# Altium project DSKY_keyboard.PrjPcb
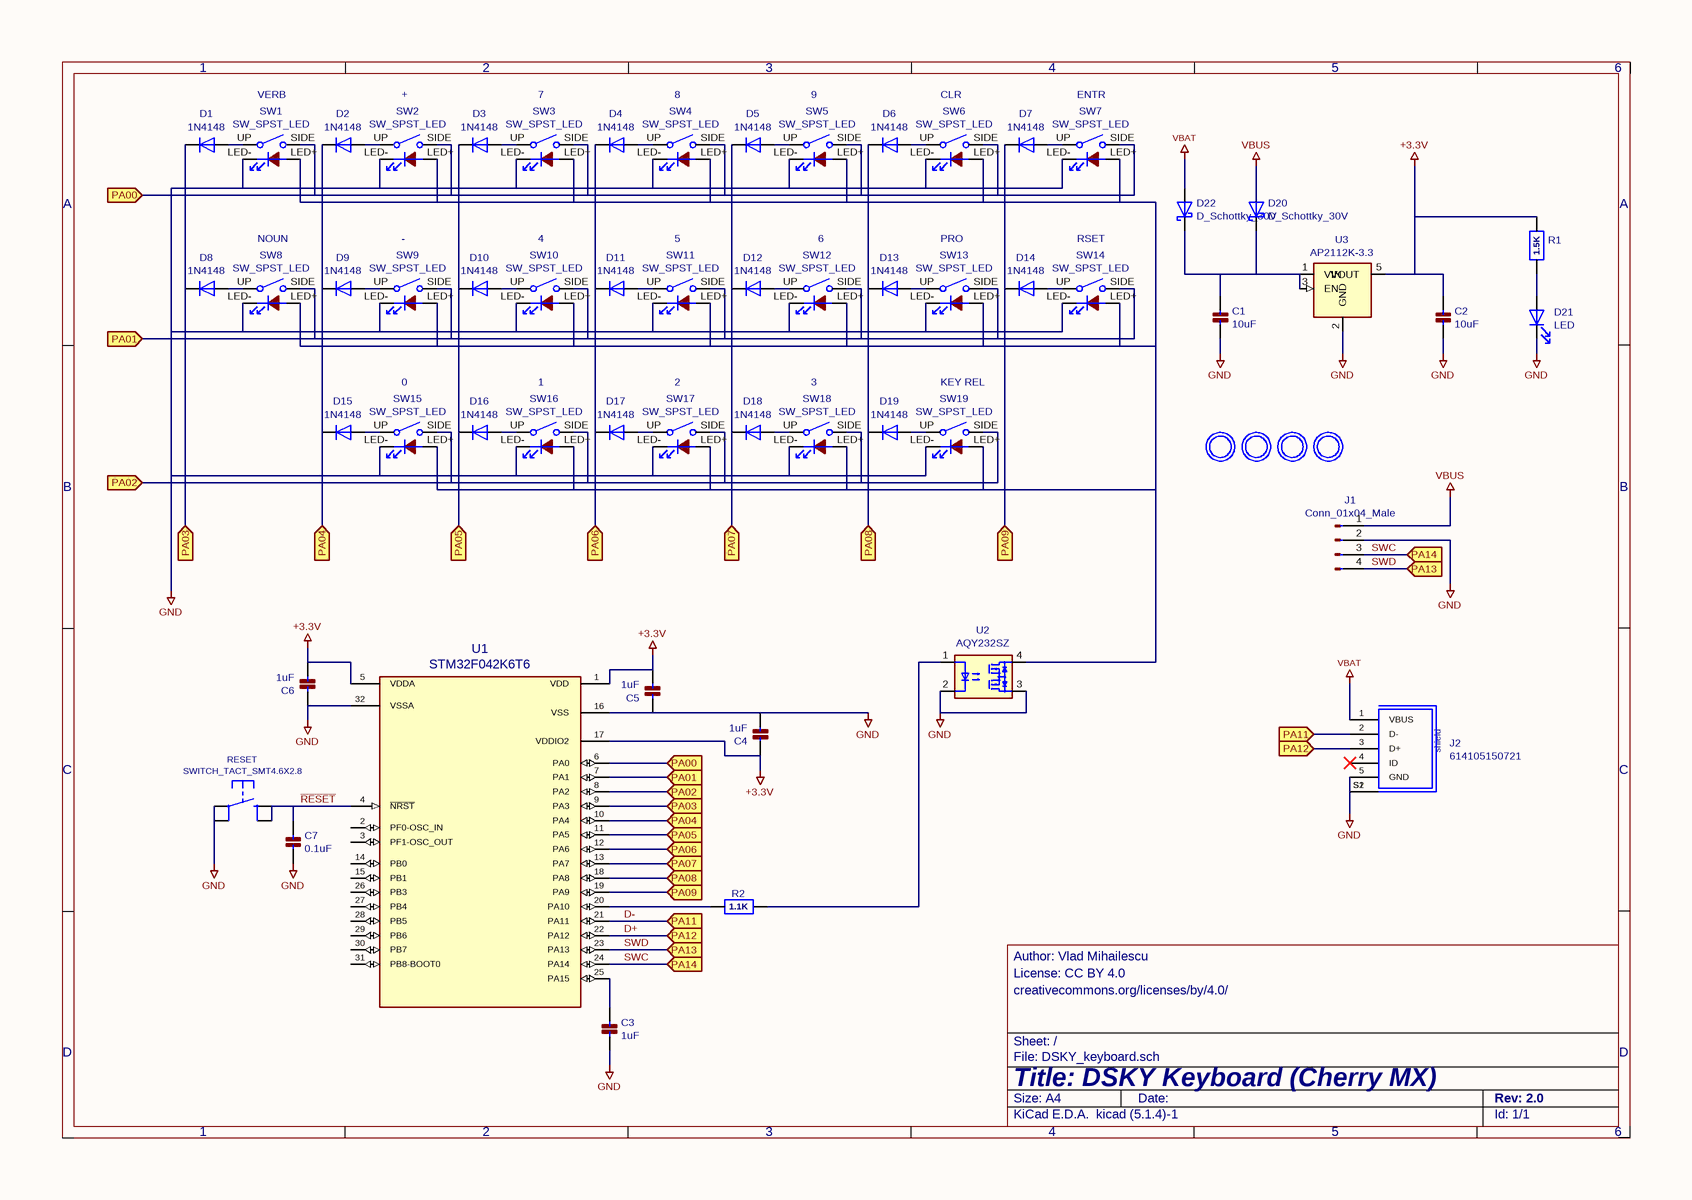
[diagram p0: DSKY_keyboard.SchDoc]
1 sheet, 60 parts. Net scope: flat (ports and power ports of the same name join across sheets).
Board file: DSKY_keyboard.PcbDoc

## Sheet DSKY_keyboard.SchDoc
size 297 x 210 mm

### Parts
C1  10uF  [0805-NO]
C2  10uF  [0805-NO]
C3  1uF  [0603-NO]
C4  1uF  [0603-NO]
C5  1uF  [0603-NO]
C6  1uF  [0603-NO]
C7  0.1uF  [0603-NO]
D1  1N4148  [SOD-123]
D2  1N4148  [SOD-123]
D3  1N4148  [SOD-123]
D4  1N4148  [SOD-123]
D5  1N4148  [SOD-123]
D6  1N4148  [SOD-123]
D7  1N4148  [SOD-123]
D8  1N4148  [SOD-123]
D9  1N4148  [SOD-123]
D10  1N4148  [SOD-123]
D11  1N4148  [SOD-123]
D12  1N4148  [SOD-123]
D13  1N4148  [SOD-123]
D14  1N4148  [SOD-123]
D15  1N4148  [SOD-123]
D16  1N4148  [SOD-123]
D17  1N4148  [SOD-123]
D18  1N4148  [SOD-123]
D19  1N4148  [SOD-123]
D20  D_Schottky_30V  [SOD-123FL]
D21  LED  [CHIPLED_0603_NOOUTLINE]
D22  D_Schottky_30V  [SOD-123FL]
J1  Conn_01x04_Male  [PinHeader_1x04_P2.54mm_Horizontal]
J2  614105150721  [614105150721]
J3  MOUNTINGHOLE3.0  [MOUNTINGHOLE_2.0_PLATED]  (value not drawn)
J4  MOUNTINGHOLE3.0  [MOUNTINGHOLE_2.0_PLATED]  (value not drawn)
J5  MOUNTINGHOLE3.0  [MOUNTINGHOLE_2.0_PLATED]  (value not drawn)
J6  MOUNTINGHOLE3.0  [MOUNTINGHOLE_2.0_PLATED]  (value not drawn)
R1  1.5K  [0603-NO]
R2  1.1K  [0603-NO]
RESET  SWITCH_TACT_SMT4.6X2.8  [BTN_KMR2_4.6X2.8]
SW1  SW_SPST_LED  [CHERRYMX-NN-LED]
SW2  SW_SPST_LED  [CHERRYMX-NN-LED]
SW3  SW_SPST_LED  [CHERRYMX-NN-LED]
SW4  SW_SPST_LED  [CHERRYMX-NN-LED]
SW5  SW_SPST_LED  [CHERRYMX-NN-LED]
SW6  SW_SPST_LED  [CHERRYMX-NN-LED]
SW7  SW_SPST_LED  [CHERRYMX-NN-LED]
SW8  SW_SPST_LED  [CHERRYMX-NN-LED]
SW9  SW_SPST_LED  [CHERRYMX-NN-LED]
SW10  SW_SPST_LED  [CHERRYMX-NN-LED]
SW11  SW_SPST_LED  [CHERRYMX-NN-LED]
SW12  SW_SPST_LED  [CHERRYMX-NN-LED]
SW13  SW_SPST_LED  [CHERRYMX-NN-LED]
SW14  SW_SPST_LED  [CHERRYMX-NN-LED]
SW15  SW_SPST_LED  [CHERRYMX-NN-LED]
SW16  SW_SPST_LED  [CHERRYMX-NN-LED]
SW17  SW_SPST_LED  [CHERRYMX-NN-LED]
SW18  SW_SPST_LED  [CHERRYMX-NN-LED]
SW19  SW_SPST_LED  [CHERRYMX-NN-LED]
U1  STM32F042K6T6  [STM32F042K6T6]
U2  AQY232SZ  [SO-4_4.4x4.3mm_P2.54mm]
U3  AP2112K-3.3  [SOT23-5]

### Ports
PA00 (in), PA01 (in), PA02 (in), PA03 (in), PA04 (in), PA05 (in), PA06 (in), PA07 (in), PA08 (in), PA09 (in), PA11 (in), PA12 (in), PA13 (in), PA14 (in)

### Nets
+3.3V: C2.1 C4.1 C5.2 C6.2 R1.1 U1.1(VDD) U1.5(VDDA) U1.17(VDDIO2) U3.5(VOUT)
GND: C1.2 C2.2 C3.2 C4.2 C5.1 C6.1 C7.2 D21.1(K) J1.2(Pin_2) J2.5(GND) J2.S1 J2.S2 RESET.A(P) RESET.A'(P1) SW1.LED- SW2.LED- SW3.LED- SW4.LED- SW5.LED- SW6.LED- SW7.LED- SW8.LED- SW9.LED- SW10.LED- SW11.LED- SW12.LED- SW13.LED- SW14.LED- SW15.LED- SW16.LED- SW17.LED- SW18.LED- SW19.LED- U1.16(VSS) U1.32(VSSA) U2.2 U2.3 U3.2(GND)
VBAT: D22.2(A) J2.1(VBUS)
VBUS: D20.2(A) J1.1(Pin_1)
D+: J2.3(D+) U1.22(PA12) ; port PA12
D-: J2.2(D-) U1.21(PA11) ; port PA11
PA00: SW1.SIDE SW2.SIDE SW3.SIDE SW4.SIDE SW5.SIDE SW6.SIDE SW7.SIDE U1.6(PA0) ; port PA00
PA01: SW8.SIDE SW9.SIDE SW10.SIDE SW11.SIDE SW12.SIDE SW13.SIDE SW14.SIDE U1.7(PA1) ; port PA01
PA02: SW15.SIDE SW16.SIDE SW17.SIDE SW18.SIDE SW19.SIDE U1.8(PA2) ; port PA02
PA03: D1.1(K) D8.1(K) U1.9(PA3) ; port PA03
PA04: D2.1(K) D9.1(K) D15.1(K) U1.10(PA4) ; port PA04
PA05: D3.1(K) D10.1(K) D16.1(K) U1.11(PA5) ; port PA05
PA06: D4.1(K) D11.1(K) D17.1(K) U1.12(PA6) ; port PA06
PA07: D5.1(K) D12.1(K) D18.1(K) U1.13(PA7) ; port PA07
PA08: D6.1(K) D13.1(K) D19.1(K) U1.18(PA8) ; port PA08
PA09: D7.1(K) D14.1(K) U1.19(PA9) ; port PA09
~{RESET}: C7.1 RESET.B(S) RESET.B'(S1) U1.4(~{NRST})
SWC: J1.3(Pin_3) U1.24(PA14) ; port PA14
SWD: J1.4(Pin_4) U1.23(PA13) ; port PA13
NetC1_1: C1.1 D20.1(K) D22.1(K) U3.1(VIN) U3.3(EN)
NetC3_1: C3.1 U1.25(PA15)
NetD1_2: D1.2(A) SW1.UP
NetD2_2: D2.2(A) SW2.UP
NetD3_2: D3.2(A) SW3.UP
NetD4_2: D4.2(A) SW4.UP
NetD5_2: D5.2(A) SW5.UP
NetD6_2: D6.2(A) SW6.UP
NetD7_2: D7.2(A) SW7.UP
NetD8_2: D8.2(A) SW8.UP
NetD9_2: D9.2(A) SW9.UP
NetD10_2: D10.2(A) SW10.UP
NetD11_2: D11.2(A) SW11.UP
NetD12_2: D12.2(A) SW12.UP
NetD13_2: D13.2(A) SW13.UP
NetD14_2: D14.2(A) SW14.UP
NetD15_2: D15.2(A) SW15.UP
NetD16_2: D16.2(A) SW16.UP
NetD17_2: D17.2(A) SW17.UP
NetD18_2: D18.2(A) SW18.UP
NetD19_2: D19.2(A) SW19.UP
NetD21_2: D21.2(A) R1.2
NetR2_1: R2.1 U2.1
NetR2_2: R2.2 U1.20(PA10)
NetSW1_LED+: SW1.LED+ SW2.LED+ SW3.LED+ SW4.LED+ SW5.LED+ SW6.LED+ SW7.LED+ SW8.LED+ SW9.LED+ SW10.LED+ SW11.LED+ SW12.LED+ SW13.LED+ SW14.LED+ SW15.LED+ SW16.LED+ SW17.LED+ SW18.LED+ SW19.LED+ U2.4

Not connected (* = marked no-connect by the designer): J2 4(ID)*; U1 2(PF0-OSC_IN) 3(PF1-OSC_OUT) 14(PB0) 15(PB1) 26(PB3) 27(PB4) 28(PB5) 29(PB6) 30(PB7) 31(PB8-BOOT0); U3 4(NC)

### Notes on the sheet
- VERB
- +
- 7
- 8
- 9
- CLR
- ENTR
- NOUN
- -
- 4
- 5
- (near SW12) 6
- PRO
- RSET
- 0
- 1
- 2
- 3
- KEY
  REL
- A
- B
- C
- creativecommons.org/licenses/by/4.0/ <http://creativecommons.org/licenses/by/4.0/>
- License: CC BY 4.0
- Author: Vlad Mihailescu
- D
- Title: DSKY Keyboard (Cherry MX)
- File: DSKY_keyboard.sch
- Sheet: /
- KiCad E.D.A.  kicad (5.1.4)-1
- Size: A4
- Date:
- Rev: 2.0
- Id: 1/1
- (in symbol 614105150721) shield

### Library data of the parts
C1-C7 = CAP_CERAMIC0805-NOOUTLINE
  C1 C2: Value: 10uF; Footprint: Trinket M0 rev D:0805-NO
  C3-C6: Value: 1uF; Footprint: Trinket M0 rev D:0603-NO
  C7: Value: 0.1uF; Footprint: Trinket M0 rev D:0603-NO
D20 D22 = D_Schottky: Value: D_Schottky_30V; Footprint: Trinket M0 rev D:SOD-123FL
J2 = 614105150721: INTERFACE-TYPE: Type B; GERDER: Receptacle; IR1: 1.8A; WORKING-VOLTAGE: 30V(AC); PACKAGING: Tape and Reel; TYPE: Vertical; DATASHEET-URL: https://www.we-online.com/catalog/datasheet/614105150721.pdf; PINS: 5; VALUE: 614105150721; APPLICATION: Micro USB 2.0; PART-NUMBER: 614105150721; MOUNT: THT; Value: 614105150721; Footprint: Footprints:614105150721
R1 R2 = RESISTOR_0603_NOOUT: Footprint: Trinket M0 rev D:0603-NO
  R1: Value: 1.5K
  R2: Value: 1.1K
SW1-SW19 = SW_GATERON_LED: Value: SW_SPST_LED; Footprint: Trinket M0 rev D:CHERRYMX-NN-LED
D1-D19 = 1N4148: Value: 1N4148; Footprint: digikey-footprints:SOD-123
D21 = LED: Value: LED; Footprint: Trinket M0 rev D:CHIPLED_0603_NOOUTLINE
J1 = Conn_01x04_Male: Value: Conn_01x04_Male; Footprint: Connector_PinHeader_2.54mm:PinHeader_1x04_P2.54mm_Horizontal
J3-J6 = MOUNTINGHOLE3.0: Value: MOUNTINGHOLE3.0; Footprint: Trinket M0 rev D:MOUNTINGHOLE_2.0_PLATED
RESET = SWITCH_TACT_SMT4.6X2.8: Value: SWITCH_TACT_SMT4.6X2.8; Footprint: Trinket M0 rev D:BTN_KMR2_4.6X2.8
U1 = STM32F042K6T6: Value: STM32F042K6T6; Footprint: STM32F042K6T6:STM32F042K6T6
U2 = AQY232SZ: Value: AQY232SZ; Footprint: Package_SO:SO-4_4.4x4.3mm_P2.54mm
U3 = AP2112K-3.3: Value: AP2112K-3.3; Footprint: Trinket M0 rev D:SOT23-5